# EAGLE schematic oshi-fuse-board-mk-1_tr5 (EAGLE 6.5.0)
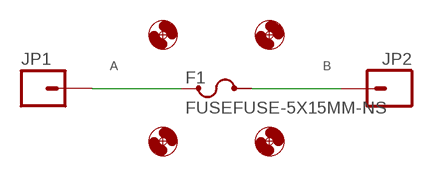
[diagram p0: schematic, sheet 1]

## Parts
F1  FUSEFUSE-5X15MM-NS  [FUSE-2AG-NS]
H1  HOLE#2  [HOLE-#2]
H2  HOLE#2  [HOLE-#2]
H3  HOLE#2  [HOLE-#2]
H4  HOLE#2  [HOLE-#2]
JP1  M01SCREW-IT  [1X01-RING-TERM-6-32]
JP2  M01SCREW-IT  [1X01-RING-TERM-6-32]

## Nets
A: F1.1 F1.1@1 JP1.P$1 JP1.P$2 JP1.P$3 JP1.P$4 JP1.P$5
B: F1.2 JP2.P$1 JP2.P$2 JP2.P$3 JP2.P$4 JP2.P$5

## Library data of the parts
F1 = A_butts:FUSE
H1-H4 = A_butts:HOLE: MOUNTING HOLE with drill center marker
JP1 JP2 = A_butts:M01: Header 1 Standard 1-pin 0.1" header. Use with straight break away headers (SKU : PRT-00116), right angle break away headers (PRT-00553), swiss pins (PRT-00743), machine pins (PRT-00117), and female headers (PRT-00115).